# EAGLE design RD01 (EAGLE 6.3)
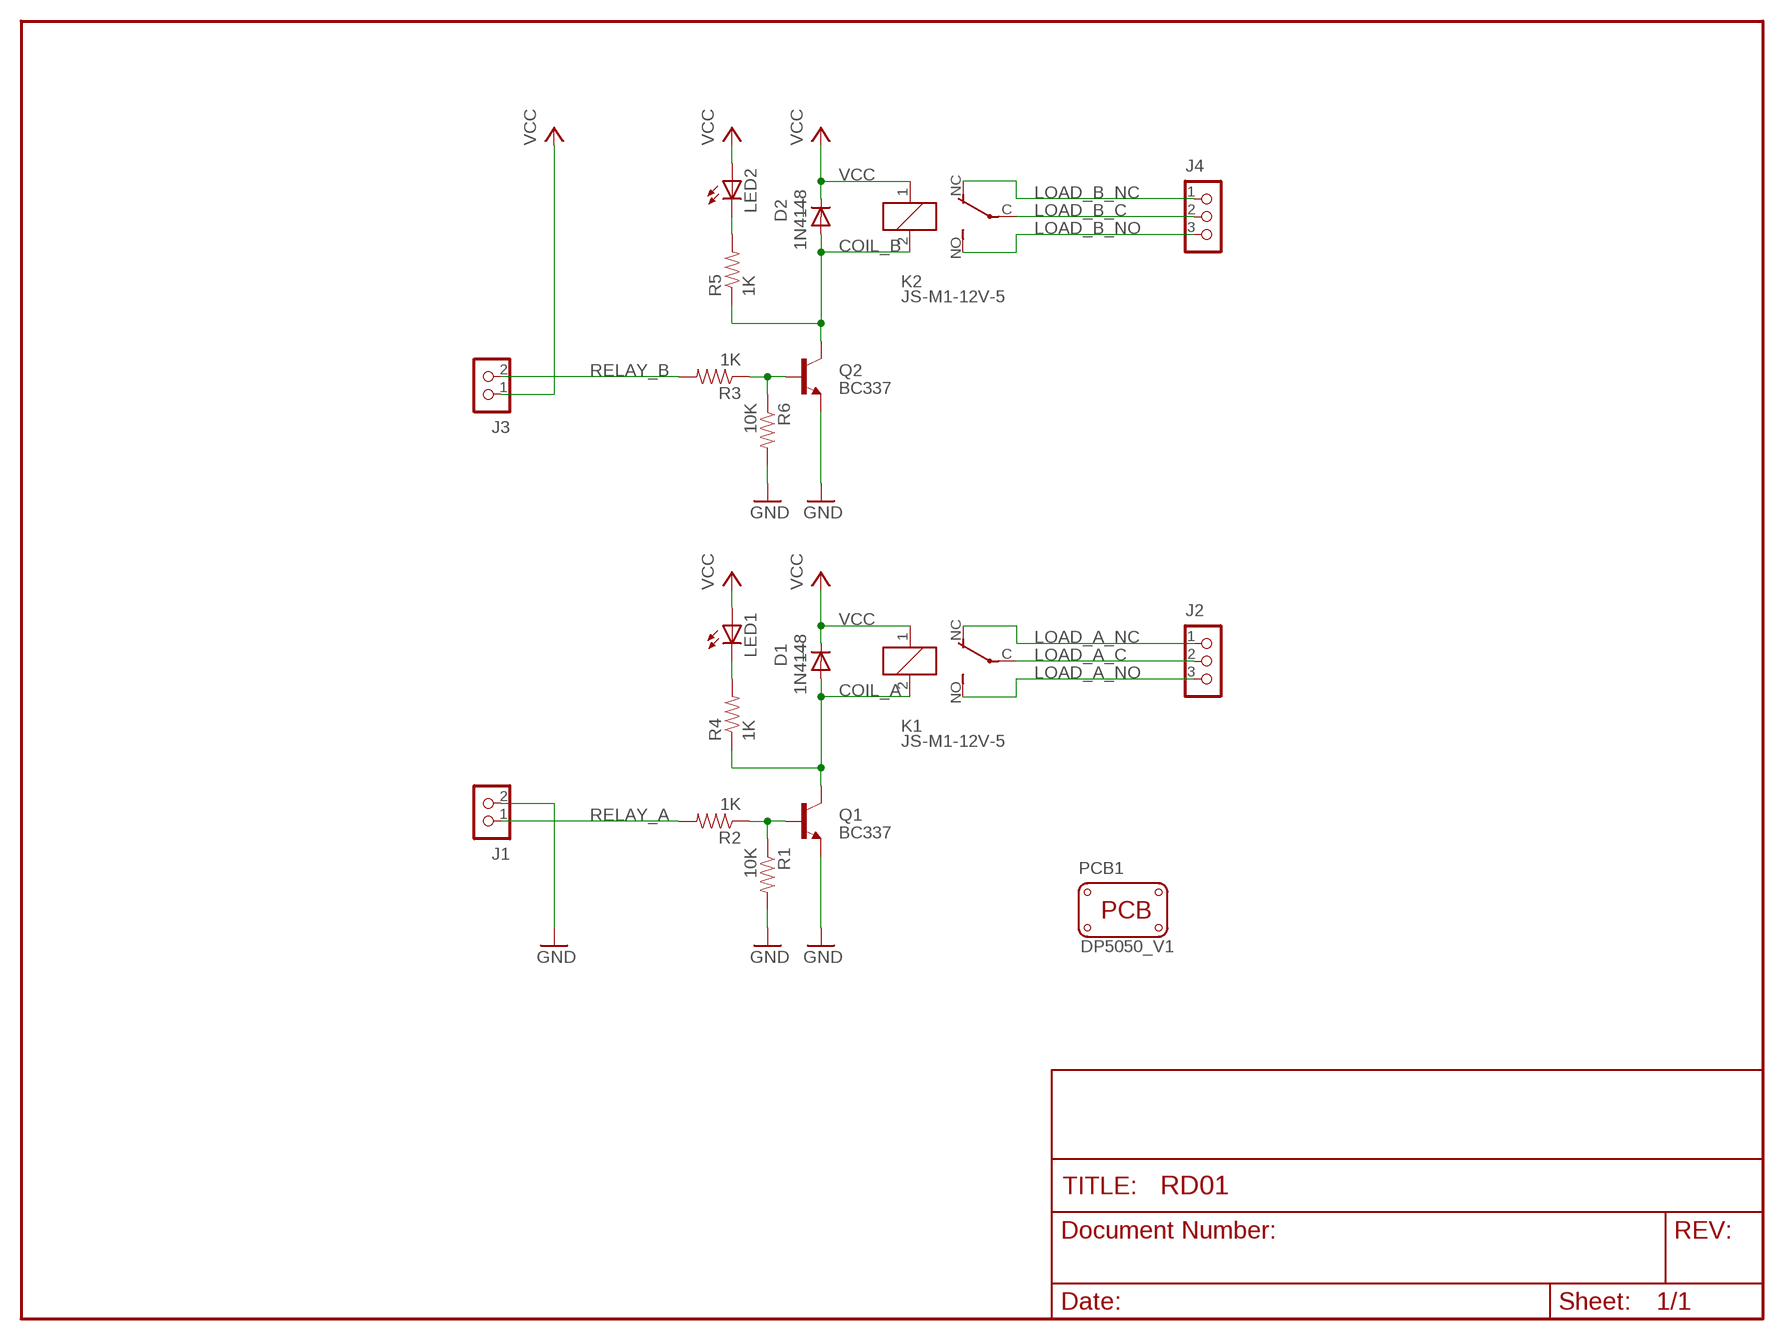
[diagram p0: schematic, sheet 1]

## Parts
D1  1N4148  DIODE1N4148  [DIODE-1N4148]
D2  1N4148  DIODE1N4148  [DIODE-1N4148]
J1  CON_TERMINAL_BLOCK_02-5MM  [TERMINAL_BLOCK_2P_5]
J2  CON_TERMINAL_BLOCK_03-5MM  [TERMINAL_BLOCK_3P_5]
J3  CON_TERMINAL_BLOCK_02-5MM  [TERMINAL_BLOCK_2P_5]
J4  CON_TERMINAL_BLOCK_03-5MM  [TERMINAL_BLOCK_3P_5]
K1  JS-M1-12V-5  [JS-M]
K2  JS-M1-12V-5  [JS-M]
LED1  LED-3MM  [LED-3MM]
LED2  LED-3MM  [LED-3MM]
PCB1  PCB_DP_SQUARE-5X5  [DP5050_V1]
Q1  BC337  [TO92]
Q2  BC337  [TO92]
R1  10K  RESISTORAXIAL-0.3  [AXIAL-0.3]
R2  1K  RESISTORAXIAL-0.3  [AXIAL-0.3]
R3  1K  RESISTORAXIAL-0.3  [AXIAL-0.3]
R4  1K  RESISTORAXIAL-0.3  [AXIAL-0.3]
R5  1K  RESISTORAXIAL-0.3  [AXIAL-0.3]
R6  10K  RESISTORAXIAL-0.3  [AXIAL-0.3]

## Nets
COIL_A: D1.A K1.2 Q1.3(C) R4.P$1
COIL_B: D2.A K2.2 Q2.3(C) R5.P$1
GND: J1.2 Q1.1(E) Q2.1(E) R1.P$2 R6.P$2
LOAD_A_C: J2.2 K1.C(2:P)
LOAD_A_NC: J2.1 K1.NC(2:O)
LOAD_A_NO: J2.3 K1.NO(2:S)
LOAD_B_C: J4.2 K2.C(2:P)
LOAD_B_NC: J4.1 K2.NC(2:O)
LOAD_B_NO: J4.3 K2.NO(2:S)
N$1: Q2.2(B) R3.P$1 R6.P$1
N$2: LED2.K(C) R5.P$2
N$6: Q1.2(B) R1.P$1 R2.P$1
N$9: LED1.K(C) R4.P$2
RELAY_A: J1.1 R2.P$2
RELAY_B: J3.2 R3.P$2
VCC: D1.C D2.C J3.1 K1.1 K2.1 LED1.A LED2.A

## Library data of the parts
D1 D2 = SparkFun:DIODE: Diode These are standard reverse protection diodes and small signal diodes. SMA package can handle up to about 1A. SOD-323 can handle about 200mA. What the SOD-323 package when ordering, there are some mfgs out there that are 5-pin packages.
J1 J3 = dp_devices:CON_TERMINAL_BLOCK_02: 2 poles wire to board terminal block
J2 J4 = dp_devices:CON_TERMINAL_BLOCK_03: 3 poles, wire to board connector
K1 K2 = relay:JS-M1*: Automotive Ultra-Miniature Power Relay NAiS Source: http://www.mew-europe.com/.. en_ds_61211_0000.pdf; MF: FARNELL; MPN: JSM1-12V-5; OC_FARNELL: 910351; OC_NEWARK: 14J1764
LED1 LED2 = dp_devices:LED: Light Emitting Diode
PCB1 = dp_devices:PCB_DP_SQUARE: Dangerous Prototypes Standard Square PCB sizes; PCB_SIZE: DP5050_V1
Q1 Q2 = transistor:BC337: NPN TRANSISTOR
R1-R6 = SparkFun:RESISTOR: Resistor Basic schematic elements and footprints for 0603, 1206, and PTH resistors.

## Board
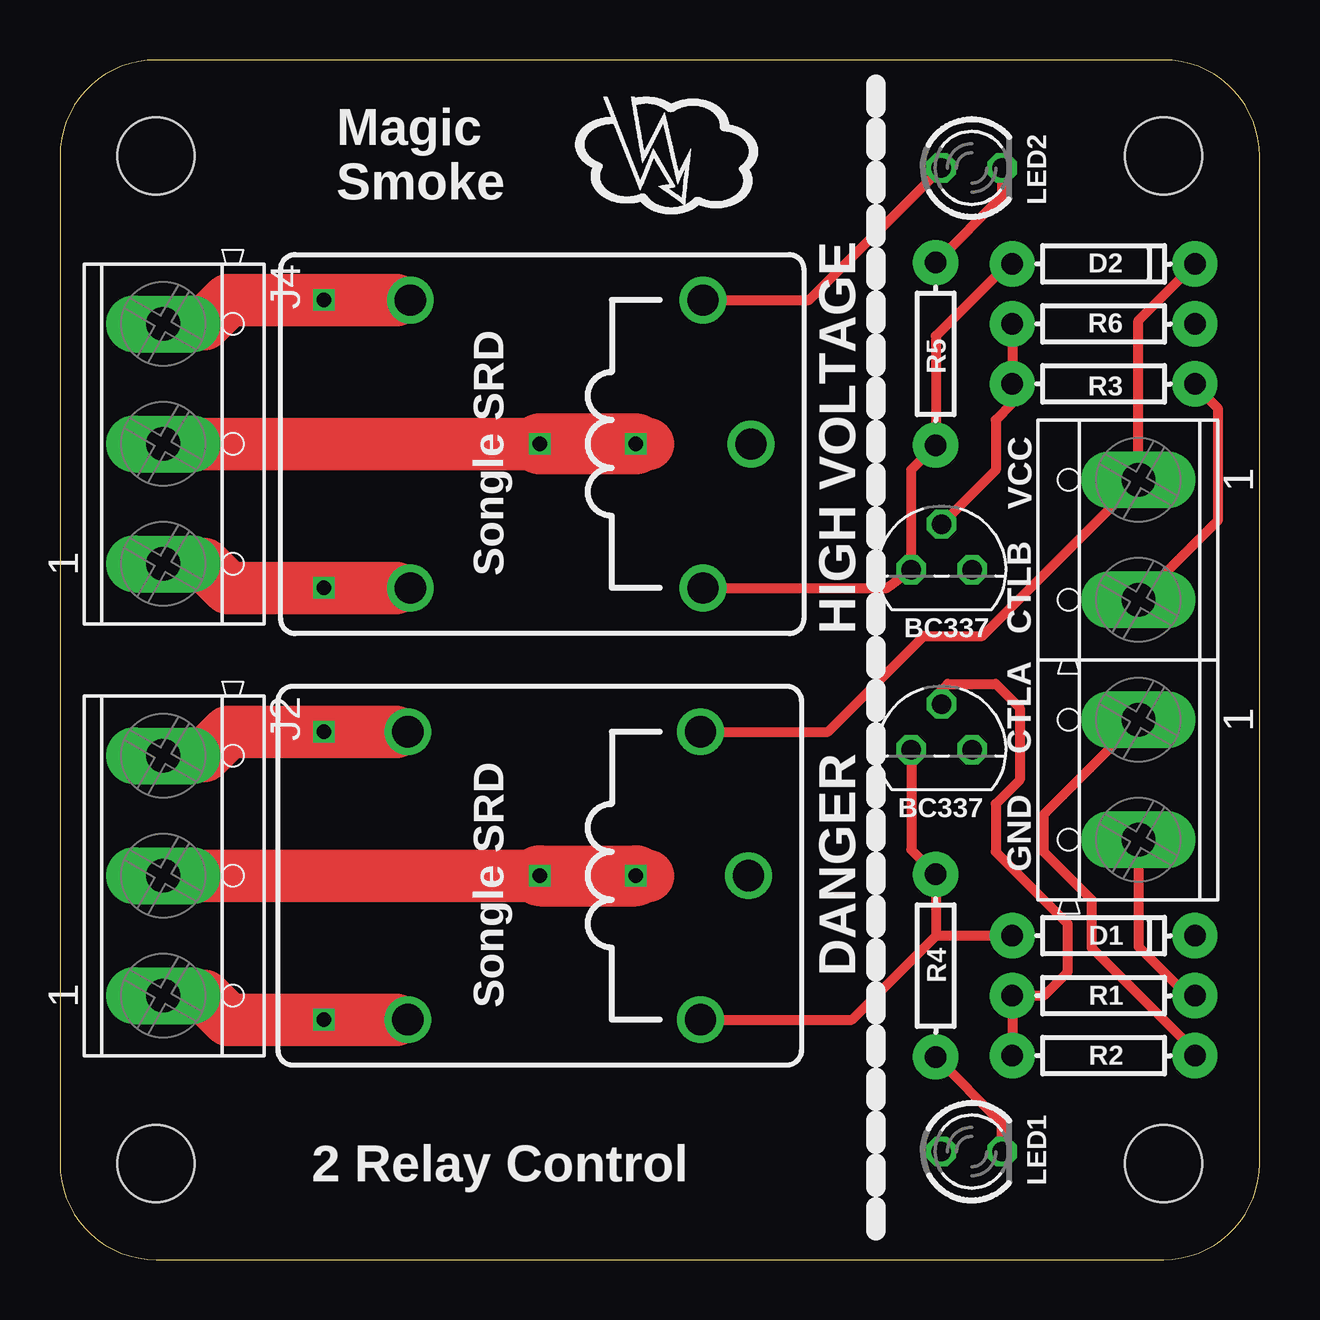
[diagram p1: board, top side]
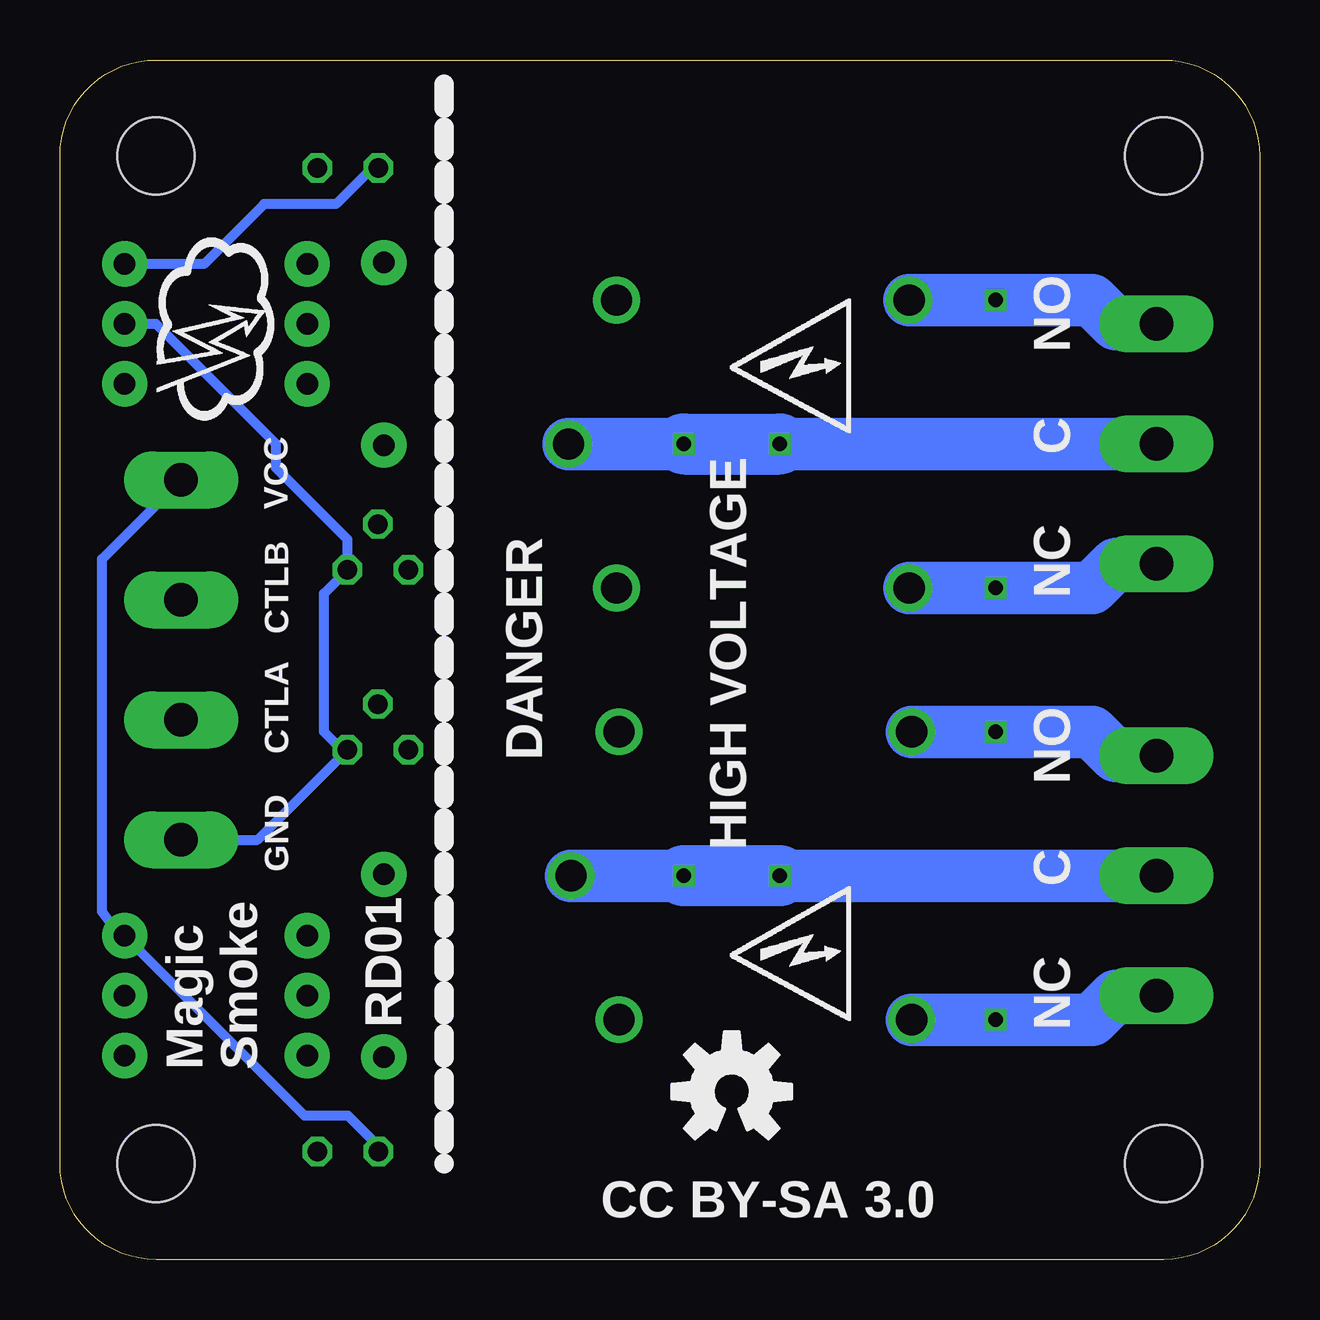
[diagram p2: board, bottom side, seen from below]

Size 50 x 50 mm. Coordinates in mm from the lower left corner, seen from the top.
Copper layers (1*2*15*16): Top 0.035mm / dielectric 0.2mm / Route2 0.0175mm / dielectric 1.1mm / Route15 0.0175mm / dielectric 0.2mm / Bottom 0.035mm
Design rules "SeeedStudio_DRU_no_angle_20130527": minimum track width 6mil, minimum drill 12mil, track to track 6mil, track to pad 6mil, pad to pad 6mil, via to via 6mil, smd to smd 0mil, copper to edge 10mil, drill to drill 10mil, minimum pad ring 6mil, minimum via ring 6mil, stop-mask expansion 2mil, vias tented up to drill 25mil, thermal gap 10mil

### Footprints (pad centres in the part's own frame; a part is rotated, then mirrored left to right if it is on the bottom)
DIODE-1N4148 = drill 0.9 pad 1.88: A -3.81,0; C 3.81,0
TERMINAL_BLOCK_2P_5 = drill 1.4 pad 2.38 long: 1 2.5,-0.45; 2 -2.5,-0.45
TERMINAL_BLOCK_3P_5 = drill 1.4 pad 2.38 long: 1 5,-0.45; 2 0,-0.45; 3 -5,-0.45
JS-M = drill 1.3: 1 6.7,6; 2 6.7,-6; C 8.7,0; NC -5.5,-6; NO -5.5,6
LED-3MM = drill 0.813 octagon: A -1.27,0; K 1.27,0
DP5050_V1 = hole 3.2: 4,4; 46,4; 46,46; 4,46
TO92 = drill 0.813 octagon: 1 1.27,0; 2 0,1.905; 3 -1.27,0
AXIAL-0.3 = drill 0.9 pad 1.88: P$1 -3.81,0; P$2 3.81,0

### Placement (x,y rotation side)
D1  43.5,13.5 0 top
D2  43.5,41.5 0 top
J1  44.5,20 90 top
J2  4.75,16 270 top
J3  44.5,30 90 top
J4  4.75,34 270 top
K1  20,16 0 top
K2  20.1,33.99 0 top
LED1  38,4.5 0 top
LED2  38,45.5 0 top
PCB1  0,0 0 top
Q1  36.75,21.25 0 top
Q2  36.75,28.75 0 top
R1  43.5,11 0 top
R2  43.5,8.5 0 top
R3  43.5,36.5 0 top
R4  36.5,12.25 270 top
R5  36.5,37.75 90 top
R6  43.5,39 0 top
U$2  [OSHW-LOGO-M]  22,7 0 bottom

### Tracks (layer width: path | path; a pad name or v marks a point on that pad's centre or on a via)
COIL_A
  Top 0.406: K1.2 33,10 36.5,13.5 | D1.A 36.5,13.5 | 36.5,13.5 R4.P$1 35.48,17.08 Q1.3
COIL_B
  Top 0.406: D2.A 39.5,41.5 36.5,38.5 R5.P$1 35.48,32.92 Q2.3 34.47,27.99 K2.2
GND
  Top 0.406: R1.P$2 47,11 44.95,13.05 J1.2
  Bottom 0.406: J1.2 41.77,17.5 Q1.1 38.25,21.25 39,22 39,27.77 Q2.1 38.02,30.02 41,33 41,34 46,39 R6.P$2
LOAD_A_C  (via drill 0.6)
  Top 2.184: 4.5,16 v20,16 | v24,16 24.5,16
  Top 2.54: v20,16 v24,16
  Bottom 2.184: J2.2 v20,16 | v24,16 K1.C
  Bottom 2.54: v20,16 v24,16
LOAD_A_NC  (via drill 0.6)
  Top 2.184: 14,10 v11,10 7,10 6,11 4,11
  Bottom 2.184: J2.1 6,11 7,10 v11,10 K1.NC
LOAD_A_NO  (via drill 0.6)
  Top 2.184: 14,22 v11,22 7,22 6,21 5,21
  Bottom 2.184: J2.3 6,21 7,22 v11,22 K1.NO
LOAD_B_C  (via drill 0.6)
  Top 2.184: 5.5,34 v20,34 | v24,34 24.5,34
  Top 2.54: v24,34 v20,34
  Bottom 2.184: J4.2 v20,34 | v24,34 K2.C
  Bottom 2.54: v24,34 v20,34
LOAD_B_NC  (via drill 0.6)
  Top 2.184: 14,28 v11,28 7,28 6,29 5,29
  Bottom 2.184: J4.1 6,29 7,28 v11,28 K2.NC
LOAD_B_NO  (via drill 0.6)
  Top 2.184: 14,40 v11,40 7,40 6,39 4,39
  Bottom 2.184: J4.3 6,39 7,40 v11,40 K2.NO
N$1
  Top 0.406: R6.P$1 R3.P$1 39.69,35.69 39,35 39,32.91 Q2.2
N$2
  Top 0.406: LED2.K 39.27,44.33 R5.P$2
N$6
  Top 0.406: Q1.2 36.75,23.75 37,24 39,24 40,23 40,20 39,19 39,17 42,14 42,12 41,11 R1.P$1 R2.P$1
N$9
  Top 0.406: LED1.K 39.27,5.67 R4.P$2
RELAY_A
  Top 0.406: R2.P$2 47.31,8.69 43,13 43,15 41,17 41,18.55 J1.1
RELAY_B
  Top 0.406: R3.P$2 47.31,36.44 48.25,35.5 48.25,30.8 J3.2
VCC
  Top 0.406: K2.1 31.22,39.99 LED2.A | K1.1 32,22 36,26 38.45,26 J3.1 44.95,39.14 D2.C
  Bottom 0.406: LED2.A 37,45.5 38.5,44 41.5,44 44,41.5 D2.C | LED1.A 36.73,4.73 38,6 39.81,6 D1.C 47.5,13.5 48.25,14.5 48.25,29.2 J3.1

### Text on the board
tPlace: Magic / Smoke | VCC | Songle SRD | HIGH VOLTAGE | CTLB | CTLA | GND | DANGER | Songle SRD | 2 Relay Control
bPlace: NO | C | VCC | NC | CTLB | DANGER | CTLA | NO | HIGH VOLTAGE | C | GND | NC | RD01 | Magic / Smoke | CC BY-SA 3.0 | /Users/thomasprice/Documents/eagle/logo/Magic_Smoke_logo.bmp